# EAGLE board 24x16_RGB_ATXMega (EAGLE 6.5.0)
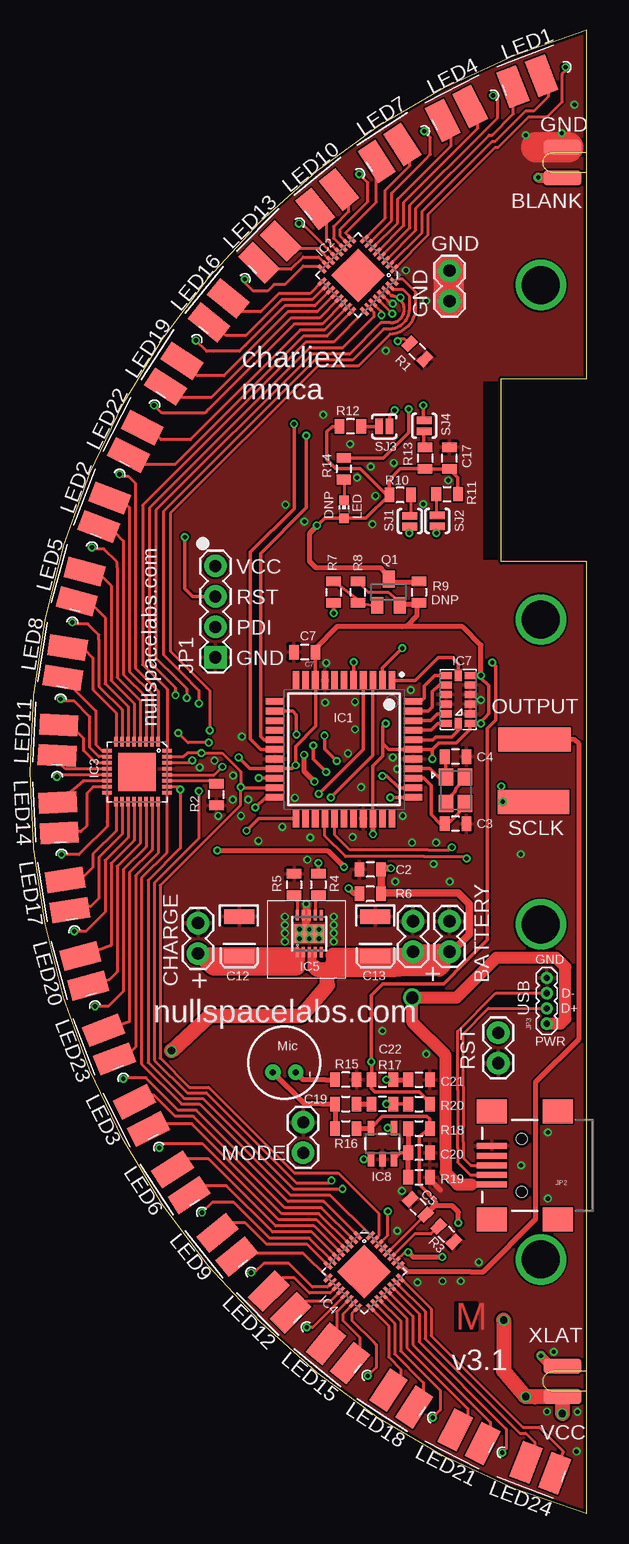
[diagram p8: board, top side]
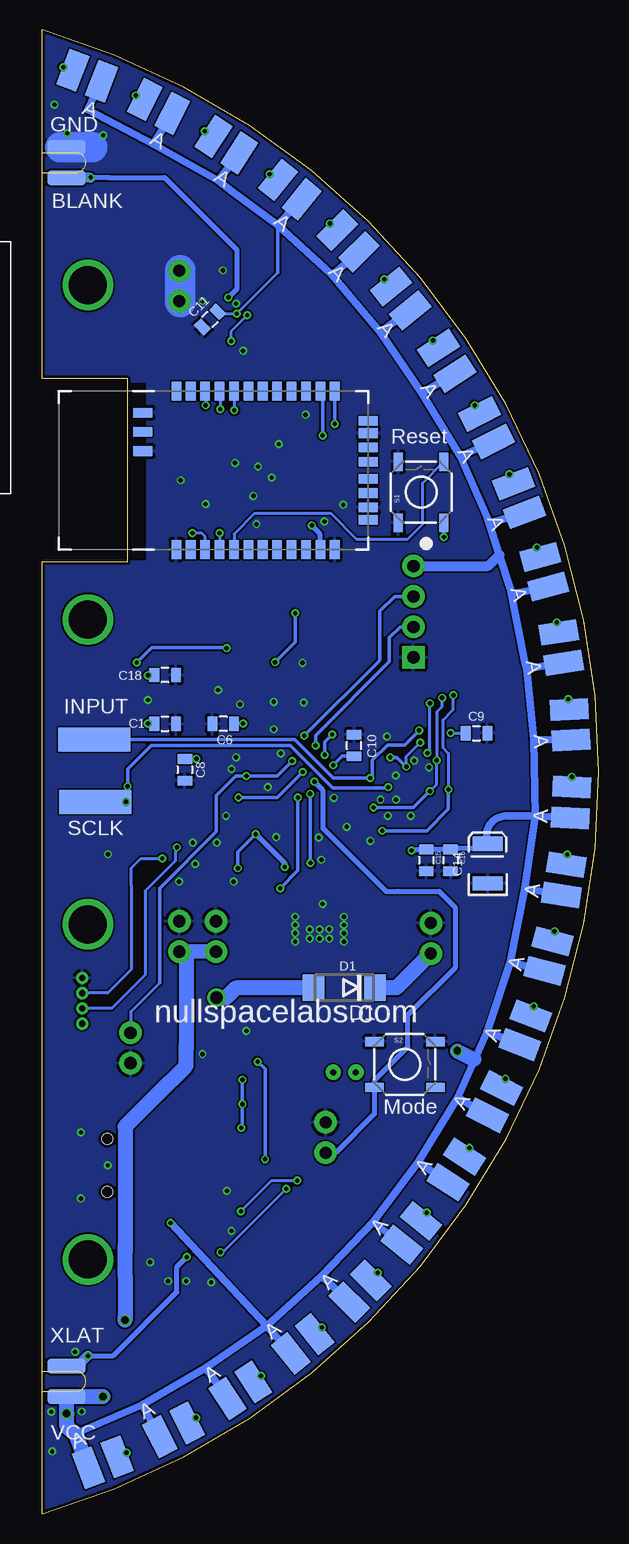
[diagram p9: board, bottom side, seen from below]

Size 46.39 x 123.7 mm. Coordinates in mm from the lower left corner, seen from the top.
Outline: 46.39,0 arc-147 46.39,123.7 46.39,94.61 39.27,94.61 39.27,79.38 46.39,79.38 46.39,0
Copper layers (1*16): Top 0.035mm / dielectric 1.5mm / Bottom 0.035mm
Design rules "ITEADstudio_DRC": minimum track width 6mil, minimum drill 12mil, track to track 6mil, track to pad 6mil, pad to pad 6mil, via to via 6mil, smd to smd 0mil, copper to edge 10mil, drill to drill 10mil, minimum pad ring 10mil, minimum via ring 6mil, stop-mask expansion 2mil, vias tented up to drill 100mil, thermal gap 10mil

## Footprints (pad centres in the part's own frame; a part is rotated, then mirrored left to right if it is on the bottom)
1X02 = drill 1.016 pad 1.88: 1 0,0; 2 2.54,0
0805 = smd 0.8 x 1.2: 1 -0.9,0; 2 0.9,0
EIA3528 = smd 1.2 x 2.5: A 1.65,0; C -1.65,0
DO214AA = smd 1.8 x 2.2: A 2.55,0; C -2.55,0
NONOLITH_TQFP-44 = smd 1.55 x 0.55: 1 -5.75,4; 2 -5.75,3.2; 3 -5.75,2.4; 4 -5.75,1.6; 5 -5.75,0.8; 6 -5.75,0; 7 -5.75,-0.8; 8 -5.75,-1.6; 9 -5.75,-2.4; 10 -5.75,-3.2; 11 -5.75,-4; 23 5.75,-4; 24 5.75,-3.2; 25 5.75,-2.4; 26 5.75,-1.6; 27 5.75,-0.8; 28 5.75,0; 29 5.75,0.8; 30 5.75,1.6; 31 5.75,2.4; 32 5.75,3.2; 33 5.75,4 | smd 0.55 x 1.55: 12 -4,-5.75; 13 -3.2,-5.75; 14 -2.4,-5.75; 15 -1.6,-5.75; 16 -0.8,-5.75; 17 0,-5.75; 18 0.8,-5.75; 19 1.6,-5.75; 20 2.4,-5.75; 21 3.2,-5.75; 22 4,-5.75; 34 4,5.75; 35 3.2,5.75; 36 2.4,5.75; 37 1.6,5.75; 38 0.8,5.75; 39 0,5.75; 40 -0.8,5.75; 41 -1.6,5.75; 42 -2.4,5.75; 43 -3.2,5.75; 44 -4,5.75
QFN32_XLP = smd 0.285 x 0.8: 1 -1.75,-2.5; 2 -1.25,-2.5; 3 -0.75,-2.5; 4 -0.25,-2.5; 5 0.25,-2.5; 6 0.75,-2.5; 7 1.25,-2.5; 8 1.75,-2.5; 17 1.75,2.5; 18 1.25,2.5; 19 0.75,2.5; 20 0.25,2.5; 21 -0.25,2.5; 22 -0.75,2.5; 23 -1.25,2.5; 24 -1.75,2.5 | smd 0.8 x 0.285: 9 2.5,-1.75; 10 2.5,-1.25; 11 2.5,-0.75; 12 2.5,-0.25; 13 2.5,0.25; 14 2.5,0.75; 15 2.5,1.25; 16 2.5,1.75; 25 -2.5,1.75; 26 -2.5,1.25; 27 -2.5,0.75; 28 -2.5,0.25; 29 -2.5,-0.25; 30 -2.5,-0.75; 31 -2.5,-1.25; 32 -2.5,-1.75 | smd 3.15 x 3.15: EP 0,0
DFN10_3X3 = smd 0.3 x 0.85: 1 -1,-1.55; 2 -0.5,-1.55; 3 0,-1.55; 4 0.5,-1.55; 5 1,-1.55; 6 1,1.55; 7 0.5,1.55; 8 0,1.55; 9 -0.5,1.55; 10 -1,1.55 | smd 2.48 x 1.55: EXP 0,0
RN41 = smd 0.8 x 1.6: 1 -6.6,-6.6; 2 -5.4,-6.6; 3 -4.2,-6.6; 4 -3,-6.6; 5 -1.8,-6.6; 6 -0.6,-6.6; 7 0.6,-6.6; 8 1.8,-6.6; 9 3,-6.6; 10 4.2,-6.6; 11 5.4,-6.6; 12 6.6,-6.6; 13 6.6,6.6; 14 5.4,6.6; 15 4.2,6.6; 16 3,6.6; 17 1.8,6.6; 18 0.6,6.6; 19 -0.6,6.6; 20 -1.8,6.6; 21 -3,6.6; 22 -4.2,6.6; 23 -5.4,6.6; 24 -6.6,6.6 | smd 1.6 x 0.8: 25 -9.4,4.8; 26 -9.4,3.2; 27 -9.4,1.6; 28 9.4,3.1; 29 9.4,-3.1; 30 9.4,-4.122; 31 9.4,-1.9; 32 9.4,-0.7; 33 9.4,0.7; 34 9.4,1.9; 35 9.4,4.122
LGA-14 = smd 0.6 x 0.9: 1 -2,-1; 2 -1.2,-1; 3 -0.4,-1; 4 0.4,-1; 5 1.2,-1; 6 2,-1; 8 2,1; 9 1.2,1; 10 0.4,1; 11 -0.4,1; 12 -1.2,1; 13 -2,1 | smd 0.9 x 0.6: 7 2,0; 14 -2,0
SOT23-5 = smd 0.55 x 1.2: 1 -0.95,-1.3; 2 0,-1.3; 3 0.95,-1.3; 4 0.95,1.3; 5 -0.95,1.3
1X04 = drill 1.016 pad 1.88 square: 1 0,0 | drill 1.016 pad 1.88: 2 2.54,0; 3 5.08,0; 4 7.62,0
USB-MINIB = smd 2.5 x 0.5: D+ 2.5,0; D- 2.5,0.8; GND 2.5,-1.6; ID 2.5,-0.8; VBUS 2.5,1.6 | smd 2.5 x 2: MTN1 -3,4.5; MTN2 2.5,4.5; MTN3 -3,-4.5; MTN4 2.5,-4.5 | hole 0.9: 0,2.2; 0,-2.2
1X04-1.27MM = drill 0.508 pad 1: 1 0,0; 2 1.27,0; 3 2.54,0; 4 3.81,0
CHIP-LED0603 = smd 0.8 x 0.8: A 0,-0.75; C 0,0.75
LED5MM_RGB_EDGE = smd 1.75 x 3.175 bottom: A -0.585,-1.6; B 1.971,-1.6 | smd 1.75 x 3.175: G 0.693,-1.6; R -1.863,-1.6
MIC-6MM = drill 0.5 pad 1.27: 1 -0.8,0.95; 2 -0.8,-0.95
SOT23 = smd 1 x 1.4: 1 -0.95,-1.1; 2 0.95,-1.1; 3 0,1.1
TACTILE_SWITCH_SMD = smd 1.524 x 0.762: 1 -2.54,1.905; 2 2.54,1.905; 3 -2.54,-1.905; 4 2.54,-1.905
SJ_2S-NO = smd 0.635 x 1.27: 1 -0.45,0; 2 0.45,0
SLOT = smd 3.175 x 1.27: P$1 2.032,1.27; P$2 2.032,-1.27 | smd 3.175 x 1.27 bottom: P$3 2.032,1.27; P$4 2.032,-1.27
TP20SQ = smd 2 x 2: TP 0,0
ZG2100MC = smd 0.85 x 0.8: 1 0.21,29.27; 2 0.21,28; 3 0.21,26.73; 4 0.21,25.46; 5 0.21,24.19; 6 0.21,22.92; 7 0.21,21.65; 8 0.21,20.38; 9 0.21,19.11; 10 0.21,17.84; 11 0.21,16.57; 12 0.21,15.3; 13 0.21,14.03; 14 0.21,12.76; 15 0.21,11.49; 16 0.21,10.22; 17 0.21,8.95; 18 0.21,7.68; 19 20.77,7.68; 20 20.77,8.95; 21 20.77,10.22; 22 20.77,11.49; 23 20.77,12.76; 24 20.77,14.03; 25 20.77,15.3; 26 20.77,16.57; 27 20.77,17.84; 28 20.77,19.11; 29 20.77,20.38; 30 20.77,21.65; 31 20.77,22.92; 32 20.77,24.19; 33 20.77,25.46; 34 20.77,26.73; 35 20.77,28; 36 20.77,29.27
NX3225GA = smd 1.4 x 1.2: 1 -1.1,-0.8; 2 1.1,-0.8; 3 1.1,0.8; 4 -1.1,0.8

## Placement (x,y rotation side)
BATTERY  [1X02]  31.91,49.4 270 top
BATTERY1  [1X02]  34.96,49.4 270 top
C1  .1uF  [0805]  36.15,65.86 0 bottom
C2  .1uF  [0805]  28.35,53.72 180 top
C3  10pF  [0805]  35.46,57.53 180 top
C4  10pF  [0805]  35.46,63.12 180 top
C5  .1uF  [0805]  32.34,25.59 135 top
C6  .1uF  [0805]  31.3,65.86 180 bottom
C7  .1uF  [0805]  22.89,71.83 180 top
C8  0.1uF  [0805]  34.5,62.03 270 bottom
C9  .1uF  [0805]  10.19,65.07 0 bottom
C10  .1uF  [0805]  20.4,64.06 90 bottom
C11  .1uF  [0805]  32.41,99.57 225 bottom
C12  4.7uF  [EIA3528]  17.43,48.13 270 top
C13  4.7uF  [EIA3528]  28.78,48.13 270 top
C14  47uF  [EIA3528]  9.28,54.2 90 bottom
C15  10uF  [0805]  14.38,54.48 270 bottom
C16  1uF  [0805]  12.35,54.48 270 bottom
C17  .1uF  [0805]  34.95,88.01 90 top
C18  0.1uF  [0805]  36.15,69.93 180 bottom
C19  4.7uF  [0805]  26.32,34.16 0 top
C20  1uF  [0805]  32.42,30.1 180 top
C21  .1uF  [0805]  32.42,36.19 0 top
C22  12pF  [0805]  29.37,36.19 0 top
CHARGE  [1X02]  14,49.25 270 top
D1  SSB44-E3/52T  [DO214AA]  21.22,43.87 180 bottom
GND  [1X02]  34.96,101.09 90 top
IC1  [NONOLITH_TQFP-44]  26.17,63.73 270 top
IC2  TLC5947XLP  [QFN32_XLP]  27.34,103.25 135 top
IC3  TLC5947XLP  [QFN32_XLP]  8.92,61.85 180 top
IC4  TLC5947XLP  [QFN32_XLP]  27.84,20.19 225 top
IC5  MCP73123  [DFN10_3X3]  23.27,48.36 0 top
IC6  BLUETOOTH-RN41"  [RN41]  28.61,87 0 bottom
IC7  MMA7455L  [LGA-14]  35.69,67.89 90 top
IC8  OPA344  [SOT23-5]  29.37,30.86 0 top
JP1  [1X04]  15.45,71.4 90 top
JP2  USBSMD  [USB-MINIB]  40.98,29.06 180 top
JP3  [1X04-1.27MM]  43.06,40.87 90 top
LED  [CHIP-LED0603]  26.17,83.74 0 top
LED1  GM1WA55311A5MM_RGB_EDGE  [LED5MM_RGB_EDGE]  41.41,121.13 21 top
LED2  GM1WA55311A5MM_RGB_EDGE  [LED5MM_RGB_EDGE]  4.91,84.6 69 top
LED3  GM1WA55311A5MM_RGB_EDGE  [LED5MM_RGB_EDGE]  7.59,33.02 117 top
LED4  GM1WA55311A5MM_RGB_EDGE  [LED5MM_RGB_EDGE]  35.34,118.43 27 top
LED5  GM1WA55311A5MM_RGB_EDGE  [LED5MM_RGB_EDGE]  2.83,78.28 75 top
LED6  GM1WA55311A5MM_RGB_EDGE  [LED5MM_RGB_EDGE]  10.91,27.26 123 top
LED7  GM1WA55311A5MM_RGB_EDGE  [LED5MM_RGB_EDGE]  29.58,115.11 33 top
LED8  GM1WA55311A5MM_RGB_EDGE  [LED5MM_RGB_EDGE]  1.45,71.78 81 top
LED9  GM1WA55311A5MM_RGB_EDGE  [LED5MM_RGB_EDGE]  14.82,21.89 129 top
LED10  GM1WA55311A5MM_RGB_EDGE  [LED5MM_RGB_EDGE]  24.21,111.2 39 top
LED11  GM1WA55311A5MM_RGB_EDGE  [LED5MM_RGB_EDGE]  0.75,65.17 87 top
LED12  GM1WA55311A5MM_RGB_EDGE  [LED5MM_RGB_EDGE]  19.26,16.95 135 top
LED13  GM1WA55311A5MM_RGB_EDGE  [LED5MM_RGB_EDGE]  19.26,106.75 45 top
LED14  GM1WA55311A5MM_RGB_EDGE  [LED5MM_RGB_EDGE]  0.75,58.53 93 top
LED15  GM1WA55311A5MM_RGB_EDGE  [LED5MM_RGB_EDGE]  24.21,12.5 141 top
LED16  GM1WA55311A5MM_RGB_EDGE  [LED5MM_RGB_EDGE]  14.84,101.79 51 top
LED17  GM1WA55311A5MM_RGB_EDGE  [LED5MM_RGB_EDGE]  1.45,51.92 99 top
LED18  GM1WA55311A5MM_RGB_EDGE  [LED5MM_RGB_EDGE]  29.58,8.59 147 top
LED19  GM1WA55311A5MM_RGB_EDGE  [LED5MM_RGB_EDGE]  10.96,96.41 57 top
LED20  GM1WA55311A5MM_RGB_EDGE  [LED5MM_RGB_EDGE]  2.83,45.42 105 top
LED21  GM1WA55311A5MM_RGB_EDGE  [LED5MM_RGB_EDGE]  35.34,5.27 153 top
LED22  GM1WA55311A5MM_RGB_EDGE  [LED5MM_RGB_EDGE]  7.61,90.65 63 top
LED23  GM1WA55311A5MM_RGB_EDGE  [LED5MM_RGB_EDGE]  4.88,39.09 111 top
LED24  GM1WA55311A5MM_RGB_EDGE  [LED5MM_RGB_EDGE]  41.41,2.57 159 top
MIC1  MIC6MM  [MIC-6MM]  21.19,37.62 90 top
MODE  [1X02]  22.76,32.64 270 top
Q1  BSH201  [SOT23]  29.88,76.83 0 top
R1  20K  [0805]  32.27,96.91 135 top
R2  20K  [0805]  15.53,59.97 90 top
R3  20K  [0805]  34.69,23.32 135 top
R4  1K  [0805]  24.03,52.45 270 top
R5  1K  [0805]  22,52.45 270 top
R6  220K  [0805]  28.35,51.69 180 top
R7  10k  [0805]  25.3,76.83 270 top
R8  10k  [0805]  27.33,76.83 90 top
R9  0ohm DNP  [0805]  32.42,76.83 270 top
R10  1k  [0805]  30.84,84.94 180 top
R11  1k  [0805]  34.75,85.01 0 top
R12  1k  [0805]  26.7,90.65 180 top
R13  1k  [0805]  32.92,88.01 270 top
R14  220  [0805]  26.14,87.12 270 top
R15  4.7k  [0805]  26.32,36.19 180 top
R16  2.2k  [0805]  26.32,32.13 0 top
R17  10k  [0805]  29.37,34.16 180 top
R18  10k  [0805]  32.42,32.13 0 top
R19  10k  [0805]  32.42,28.07 0 top
R20  1M  [0805]  32.42,34.16 0 top
RST  [1X02]  39.02,37.57 90 top
S1  [TACTILE_SWITCH_SMD]  14.81,85.17 90 bottom
S2  [TACTILE_SWITCH_SMD]  16.16,37.46 0 bottom
SJ1  SOLDERJUMPERNO  [SJ_2S-NO]  31.65,82.75 90 top
SJ2  SOLDERJUMPERNO  [SJ_2S-NO]  33.94,82.78 90 top
SJ3  SOLDERJUMPERNO  [SJ_2S-NO]  29.52,90.65 180 top
SJ4  SOLDERJUMPERNO  [SJ_2S-NO]  32.85,90.7 270 top
SLOT1  SLOT  [SLOT]  46.39,11.05 180 top
SLOT2  SLOT  [SLOT]  46.39,112.65 180 top
TP1  TPTP20SQ  [TP20SQ]  42.04,64.57 0 top
TP2  TPTP20SQ  [TP20SQ]  40.04,64.57 0 top
TP3  TPTP20SQ  [TP20SQ]  41.97,59.36 0 top
TP4  TPTP20SQ  [TP20SQ]  39.99,59.36 0 bottom
TP5  TPTP20SQ  [TP20SQ]  42.04,64.57 0 bottom
TP6  TPTP20SQ  [TP20SQ]  40.04,64.57 0 bottom
TP7  TPTP20SQ  [TP20SQ]  43.97,59.36 0 bottom
TP8  TPTP20SQ  [TP20SQ]  41.99,59.36 0 bottom
TP9  TPTP20SQ  [TP20SQ]  44.05,64.57 0 top
TP10  TPTP20SQ  [TP20SQ]  39.99,59.36 0 top
TP11  TPTP20SQ  [TP20SQ]  44.05,64.57 0 bottom
TP12  TPTP20SQ  [TP20SQ]  43.95,59.36 0 top
U$5  ZG2100MC  [ZG2100MC]  80.02,106.04 270 bottom  (outside the outline)
X1  NX3225GA XC1972CT-ND  [NX3225GA]  35.46,60.32 270 top

## Tracks (layer width: path | path; a pad name or v marks a point on that pad's centre or on a via)
!CS
  Top 0.305: IC7.7 35.67,69.92 35.67,70.89 35.19,71.37 34.02,71.37 32.12,69.48 IC1.1
BATTSENSE  (via drill 0.36)
  Top 0.305: v25.08,59.71 28.57,63.21 IC1.3
  Top 0.406: R6.2 27.01,51.69 v26.55,52.15
  Bottom 0.305: v26.55,52.15 25.08,53.62 v25.08,59.71
BLANK  (via drill 0.36)
  Top 0.254: v13.52,62.81 13.4,62.6 IC3.30 | v25.13,27.79 24.95,27.61 22.18,27.61 14.69,35.1 13.09,35.1 10.37,37.82 10.37,52.6 14.08,56.31 v14.08,60.25 | 30.1,101.55 30.11,101.55 arc-177 30.05,99.29 29.24,99.29 26.63,96.67 23.5,96.67 10.5,83.67 10.5,71.35 12.22,69.62 13.06,68.78 v13.06,68.02 | 30.1,101.55 IC2.30 | 30.1,101.55 30.1,101.57 v30.87,101.4 | 44.33,111.4 SLOT2.P$3 | IC4.30 29.83,23.23 v29.83,25.22
  Top 0.305: IC1.22 19.63,59.73 v18.78,58.88
  Top 0.813: v42.35,111.4 44.33,111.4
  Bottom 0.254: v42.35,111.4 42.37,111.38 | v13.06,68.02 13.06,67.28 13.52,66.83 v13.52,62.81 13.52,60.81 v14.08,60.25 | v29.83,25.22 27.26,27.79 v25.13,27.79
  Bottom 0.305: v18.78,58.88 15.45,58.88 v14.08,60.25
  Bottom 0.406: v42.35,111.4 40.87,111.4 36.18,111.4 30.16,105.38 30.16,102.11 v30.87,101.4
  Bottom 0.813: 42.37,111.38 SLOT2.P$3
BT_PWR  (via drill 0.36)
  Top 0.305: v26.98,70.99 v26.97,70.98 IC1.5 | R7.2 v25.3,75.08
  Bottom 0.305: v25.3,75.08 25.3,72.67 v26.98,70.99
BT_RST
  Bottom 0.254: S1.4 14.69,85.93 14.69,82.5 15.91,81.28 20.2,81.28 22.33,83.41 28.66,83.41 30.38,81.69 30.38,80.42
  Bottom 0.305: 30.38,80.42 IC6.5
BUTTON  (via drill 0.36)
  Top 0.305: IC1.13 21.88,66.93 22.21,66.6 v22.21,64.97
  Top 0.406: v23.7,61.04 22.84,61.9 v22.84,63.27
  Bottom 0.254: 18.65,35.46 S2.3
  Bottom 0.305: v22.84,63.27 22.84,64.34 v22.21,64.97
  Bottom 0.406: MODE.2 21.93,30.1 18.7,33.32 S2.3 18.7,36.12 15.91,38.91 15.91,41.58 11.97,45.52 11.97,50.57 13.29,51.89 16.74,51.89 17.74,51.89 22.23,56.39 22.97,57.12 22.97,60.3 v23.7,61.04
CHARGE
  Top 0.254: IC5.1 21.92,46.46 21.82,46.46 | 21.82,46.46 C12.A | 22.13,47.07 22.82,47.07 22.82,46.46 21.82,46.46 | 21.82,46.46 21.82,46.56
  Top 0.305: IC5.2 IC5.1 22.27,46.74
  Top 0.813: 22.17,46.71 IC5.1
  Top 1.27: CHARGE.2 15.2,45.52 22.28,45.52 22.28,46.25 21.95,46.58 14.33,46.58 14.43,46.48 C12.A
  Bottom 1.016: 14,46.48 CHARGE.2
  Bottom 1.27: D1.C 16.85,43.87 CHARGE.2
COL1  (via drill 0.36)
  Top 0.254: IC2.1 33.18,106.62 33.18,108.33 38.77,113.92 39.02,113.92 41.56,116.46 42.83,116.46 43.11,116.46 44.35,117.7 44.35,120.04 44.63,120.32 v44.63,120.6
  Bottom 0.305: LED1.B 44.1,120.07 v44.63,120.6
COL2
  Top 0.254: IC2.2 32.67,106.82 32.67,108.58 38.51,114.43 38.77,114.43 41.31,116.97 42.02,116.97 43.21,118.16 43.21,119.31 LED1.G
COL3
  Top 0.254: IC2.3 32.16,107.02 32.16,108.84 38.26,114.94 38.51,114.94 40.29,116.71 40.29,118.75 LED1.R
COL4  (via drill 0.36)
  Top 0.254: IC2.4 31.65,107.22 31.65,109.09 37.67,115.09 38.97,116.38 38.97,117.6 38.97,117.86 v38.59,118.24
  Bottom 0.254: LED4.B arc-90 38.46,117.25 38.46,118.11 v38.59,118.24
COL5
  Top 0.254: IC2.5 31.15,107.41 31.15,109.35 37.32,115.52 37.32,116.15 36.68,116.79 LED4.G
COL6
  Top 0.254: IC2.6 30.64,107.61 30.64,109.6 35.08,114.05 35.08,114.96 34.4,115.64 LED4.R
COL7  (via drill 0.36)
  Top 0.254: IC2.7 30.13,107.81 30.13,110.11 32.92,112.9 33.36,113.33 33.36,114.76 v32.85,115.26
  Bottom 0.254: LED7.B 32.11,114.36 v32.85,115.26
COL8
  Top 0.254: IC2.8 29.62,108.01 29.62,110.36 31.65,112.39 31.65,113.06 31.5,113.21 31.5,113.67 LED7.G
COL9
  Top 0.254: IC2.9 26.32,106.74 26.32,106.81 28.86,109.35 28.86,112.39 LED7.R
COL10  (via drill 0.36)
  Top 0.254: IC2.10 25.81,106.54 25.81,107.06 27.59,108.84 28.15,109.4 28.15,110.31 28.15,110.97 v27.44,111.68
  Bottom 0.254: 26.74,110.88 LED10.B 26.95,111.19 v27.44,111.68 27.59,110.03
COL11
  Top 0.254: IC2.11 25.3,106.34 25.3,107.31 26.57,108.58 26.57,109.09 25.51,110.16 LED10.G
COL12
  Top 0.254: IC2.12 24.72,106.22 24.72,107.83 LED10.R
COL13  (via drill 0.36)
  Top 0.254: IC2.13 22.92,107.31 v22.41,107.57
  Bottom 0.254: LED13.B v22.41,107.57
COL14
  Top 0.254: IC2.14 24.07,105.46 21.9,105.46 21.25,106.11 LED13.G
COL15
  Top 0.254: IC2.15 24.04,104.78 22.76,104.78 21.75,103.76 20.05,103.76 19.5,104.3 LED13.R
COL16  (via drill 0.36)
  Top 0.254: IC2.16 24.1,104.01 22.76,104.01 21.24,102.49 20.35,102.49 19.79,101.93 18.6,101.93 17.89,102.64 v17.89,102.92
  Bottom 0.254: LED16.B 17.51,102.31 v17.89,102.92
COL17
  Top 0.254: IC2.17 23.34,101.73 20.73,101.73 19.21,100.2 17.43,100.2 16.53,101.1 LED16.G
COL18
  Top 0.254: IC2.18 23.54,101.22 20.99,101.22 17.99,98.22 16.31,98.22 15.2,99.33 LED16.R
COL19  (via drill 0.36)
  Top 0.254: IC2.19 23.74,100.71 21.24,100.71 17.94,97.41 17.46,96.93 15.27,96.93 14.71,96.93 v13.82,97.81
  Bottom 0.254: LED19.B 13.6,97.41 v13.82,97.81
COL20
  Top 0.254: IC2.20 23.94,100.2 21.49,100.2 16.16,94.87 13.93,94.87 LED19.G 12.86,95.88
COL21
  Top 0.254: IC2.21 24.13,99.69 21.75,99.69 15.12,93.07 12.66,93.07 11.75,93.97 LED19.R
COL22  (via drill 0.36)
  Top 0.254: IC2.22 24.33,99.19 22,99.19 14.89,92.07 14.59,91.77 11.46,91.77 10.98,91.77 v10.34,92.41
  Bottom 0.254: LED22.B 10.43,91.68 arc90 v10.34,92.41
COL23
  Top 0.254: IC2.23 24.53,98.68 22.51,98.68 13.37,89.53 10.93,89.53 10.55,89.92 9.98,89.92 LED22.G 10.07,90.29
COL24
  Top 0.254: IC2.24 24.73,98.17 22.76,98.17 12.07,87.48 8.98,87.48 LED22.R
COL25  (via drill 0.36)
  Top 0.254: IC3.1 10.67,68.61 8.79,70.48 8.79,85.9 8.21,86.49 7.63,86.49 v7.45,86.66
  Bottom 0.254: LED2.B 7.59,85.87 arc90 v7.45,86.66
COL26
  Top 0.254: IC3.2 10.17,68.35 8.29,70.23 8.29,83.9 7.91,84.28 7.05,84.28 LED2.G
COL27
  Top 0.254: IC3.3 9.67,68.08 7.78,69.98 7.78,81.1 7.04,81.84 6.19,81.84 LED2.R
COL28  (via drill 0.36)
  Top 0.254: IC3.4 9.17,67.82 7.27,69.72 7.27,78.89 7.27,79.32 6.15,80.44 5.29,80.44 v5.16,80.57
  Bottom 0.254: LED5.B 5.46,79.77 v5.16,80.57
COL29
  Top 0.254: IC3.5 8.67,67.56 6.76,69.47 6.76,77.37 6,78.13 4.96,78.13 LED5.G
COL30
  Top 0.254: IC3.6 8.17,67.3 6.25,69.22 6.25,74.73 5.26,75.72 4.25,75.72 LED5.R
COL31  (via drill 0.36)
  Top 0.254: IC3.7 7.67,67.04 5.75,68.96 5.75,72.85 5.75,73.28 4.83,74.19 3.64,74.19 v3.51,74.32
  Bottom 0.254: LED8.B 4.04,73.48 v3.51,74.32
COL32
  Top 0.254: IC3.8 7.17,66.77 5.24,68.71 5.24,71.35 4.55,72.03 3.32,72.03 LED8.G
COL33
  Top 0.254: IC3.9 6.03,63.6 5.49,64.13 5.49,66.93 2.85,69.57 LED8.R
COL34  (via drill 0.36)
  Top 0.254: IC3.10 6.4,63.12 5.75,63.12 4.98,63.88 4.98,65.99 4.98,66.45 3.69,67.74 2.72,67.74 v2.55,67.92
  Bottom 0.254: LED11.B 2.75,67.06 v2.55,67.92
COL35
  Top 0.254: LED11.G 2.44,65.41 3.71,65.41 4.48,64.64 4.48,63.63 5.5,62.6 IC3.11
COL36
  Top 0.254: IC3.12 2.95,62.1 2.29,62.76 LED11.R
COL37  (via drill 0.36)
  Top 0.254: IC3.13 2.95,61.59 2.39,61.59 v2.24,61.44
  Bottom 0.254: LED14.B 2.25,60.78 v2.24,61.44
COL38
  Top 0.254: 6.42,61.09 IC3.14 4.43,61.1 LED14.G
COL39
  Top 0.254: IC3.15 5.26,60.6 4.73,60.07 4.73,57.35 4.25,56.87 2.57,56.87 LED14.R
COL40  (via drill 0.36)
  Top 0.254: IC3.16 6.42,57.7 6.42,57.32 4.32,55.22 4.07,54.97 v2.62,54.97
  Bottom 0.254: LED17.B 2.72,54.35 v2.62,54.97
COL41
  Top 0.254: IC3.17 7.17,56.92 5.24,54.99 5.24,53.9 4.45,53.11 3.18,53.11 LED17.G 3.13,52.7
COL42
  Top 0.254: IC3.18 7.67,56.66 5.75,54.74 5.75,51.31 5.06,50.62 3.62,50.62 LED17.R
COL43  (via drill 0.36)
  Top 0.254: IC3.19 8.17,56.4 6.25,54.48 6.25,50.16 4.65,48.56 v3.69,48.56
  Bottom 0.254: LED20.B 3.87,48.31 v3.69,48.56
COL44
  Top 0.254: IC3.20 8.67,56.14 6.76,54.23 6.76,47.37 4.68,46.61 LED20.G
COL45
  Top 0.254: IC3.21 9.17,55.88 7.27,53.97 7.27,45.19 6.61,44.53 LED20.R
COL46  (via drill 0.36)
  Top 0.254: IC3.22 9.67,55.61 7.78,53.72 7.78,43.56 6.53,42.32 v5.42,42.32
  Bottom 0.254: LED23.B v5.42,42.32
COL47
  Top 0.254: IC3.23 10.17,55.35 8.29,53.47 8.29,41.02 LED23.G 6.73,40.51
COL48
  Top 0.254: IC3.24 10.67,55.09 8.79,53.21 8.79,38.91 8.24,38.35 7.47,38.35 LED23.R
COL49  (via drill 0.36)
  Top 0.254: IC4.1 24.48,26.03 21.49,26.03 13.87,33.66 12.35,33.66 9.66,36.35 7.85,36.35 v7.78,36.27
  Bottom 0.254: LED3.B 8.26,35.64 v7.78,36.27
COL50
  Top 0.254: IC4.2 24.28,25.53 21.24,25.53 13.62,33.15 12.1,33.15 10.34,34.9 9.56,34.9 9.02,34.36 LED3.G
COL51
  Top 0.254: IC4.3 24.08,25.02 20.99,25.02 13.49,32.51 10.95,32.51 10.53,32.09 LED3.R
COL52  (via drill 0.36)
  Top 0.254: IC4.4 23.88,24.51 20.73,24.51 14.56,30.68 14.38,30.86 11.54,30.86 11.13,30.86 v10.78,30.5
  Bottom 0.254: v10.78,30.5 11.36,29.79 LED6.B
COL53
  Top 0.254: IC4.5 23.68,24 20.48,24 14.89,29.59 13.06,29.59 12.19,28.72 LED6.G
COL54
  Top 0.254: IC4.6 23.48,23.49 20.22,23.49 16.36,27.36 14.33,27.36 13.55,26.57 LED6.R
COL55  (via drill 0.36)
  Top 0.254: IC4.7 23.28,22.99 19.97,22.99 17.81,25.15 17,25.96 15.17,25.96 v14.33,25.12
  Bottom 0.254: LED9.B 14.87,24.47 v14.33,25.12
COL56
  Top 0.254: IC4.8 23.08,22.48 19.72,22.48 17.94,24.26 16.92,24.26 15.86,23.19 LED9.G
COL57
  Top 0.254: IC4.9 22.78,21.72 17.18,21.72 17.23,21.66 LED9.R
COL58  (via drill 0.36)
  Top 0.254: IC4.10 24.81,18.92 23.53,18.92 21.55,20.9 19.49,20.9 18.7,20.12 v18.42,20.12
  Bottom 0.254: LED12.B v18.42,20.12
COL59
  Top 0.254: IC4.11 25.01,18.41 23.27,18.41 22,19.68 21.04,19.68 19.92,18.57 LED12.G 20.16,18.35
COL60
  Top 0.254: IC4.12 25,17.7 22.54,17.7 arc90 22.21,17.37 22.21,17.25 arc-90 LED12.R
COL61  (via drill 0.36)
  Top 0.254: IC4.13 23.55,15.54 v23.07,15.54
  Bottom 0.254: LED15.B 23.68,15.88 v23.07,15.54
COL62
  Top 0.254: IC4.14 25.56,16.85 25.56,15.11 24.91,14.47 LED15.G
COL63
  Top 0.254: IC4.15 26.07,16.65 26.07,16.13 27.49,14.71 27.49,13.31 26.75,12.57 LED15.R
COL64  (via drill 0.36)
  Top 0.254: IC4.16 26.83,16.7 26.83,16.13 28.63,14.33 28.86,14.1 28.86,12.57 28.86,12.22 v28.15,11.51
  Bottom 0.254: LED18.B 28.67,11.01 v28.15,11.51
COL65
  Top 0.254: IC4.17 29.88,15.69 29.88,13.08 30.89,12.06 30.89,11.3 30.13,10.54 LED18.G
COL66
  Top 0.254: IC4.18 30.38,15.88 30.38,13.33 32.77,10.95 32.77,10.08 32.02,9.33 LED18.R
COL67  (via drill 0.36)
  Top 0.254: IC4.19 30.89,16.08 30.89,13.59 34.19,10.29 34.19,8.66 v33.56,8.03
  Bottom 0.254: LED21.B 34.1,7.59 v33.56,8.03
COL68
  Top 0.254: IC4.20 31.4,16.28 31.4,13.84 36.48,8.76 36.48,8.25 35.72,7.5 LED21.G
COL69
  Top 0.254: IC4.21 31.91,16.48 31.91,14.1 38.36,7.64 38.36,6.91 37.72,6.27 LED21.R
COL70  (via drill 0.36)
  Top 0.254: IC4.22 32.42,16.68 32.42,14.35 39.66,7.11 39.71,7.06 39.71,5.82 39.71,5.46 v39.35,5.1
  Bottom 0.254: LED24.B 39.66,5.25 v39.35,5.1
COL71
  Top 0.254: IC4.23 32.92,16.88 32.92,14.6 40.8,6.73 41.31,6.73 42.07,5.97 42.07,5.46 41.62,5.02 LED24.G
COL72
  Top 0.254: IC4.24 33.43,17.08 33.43,14.86 41.05,7.24 42.42,7.24 44.43,5.23 LED24.R
D+  (via drill 0.36)
  Top 0.254: IC1.27 25.41,57.94 25.41,56.59 26.65,55.35 33.18,55.35 34.93,55.35 v35.16,55.57 | JP3.2 38.21,42.14 36.1,40.03 36.1,35.64 36.1,32.23 36.1,31.01 36.1,29.69 36.73,29.06 JP2.D+
  Bottom 0.254: v35.16,55.57 35.29,55.19 35.29,54.43 37.8,51.92 37.8,44.91 40.57,42.14 JP3.2
D-  (via drill 0.36)
  Top 0.254: IC1.26 24.57,56.52 26.3,54.79 32.85,54.79 36.23,54.79 v36.38,54.63 | JP3.3 38.82,43.41 35.64,40.23 35.64,35.38 35.64,32.03 35.64,30.53 35.64,29.31 36.68,28.27 38.46,28.27 JP2.D-
  Bottom 0.254: v36.38,54.63 38.16,54.63 38.94,53.85 38.94,52.4 38.94,45.39 40.93,43.41 JP3.3
DAT  (via drill 0.36)
  Top 0.305: IC1.34 31.9,59.71 v30.03,59.71 | v23.6,64.06 23.6,62.92 v24.67,61.85
  Bottom 0.305: v30.03,59.71 26.8,59.71 v24.67,61.85 | JP1.2 16.57,73.94 17.46,73.05 17.46,71.04 23.6,64.9 v23.6,64.06
DGND
  Top 0.305: X1.2 34.66,59.32 35.13,59.92 35.39,60.17 35.54,60.5 36.26,61.3 X1.4
GND  (via drill 0.36)
  Top 0.254: v30.23,100.89 30.05,100.89 IC2.29 | 23.04,50.75 23.04,50.18 arc-90 IC5.9
  Top 0.305: 34.88,103.71 GND.2
  Top 0.406: R19.2 33.32,27.88 34.19,27
  Top 0.61: v23.27,48.72 22.99,49 22.99,49.43 23.04,49.48 23.04,50.75
  Top 2.54: 34.88,103.71 34.88,101.02 | 42.2,113.94 44.86,113.94
  Bottom 0.305: 34.88,103.68 GND.2
  Bottom 2.54: 34.88,103.68 34.88,100.99 | 42.2,113.94 44.86,113.94
  other vias: 15.68,58.19 15.37,62.79 22.46,48.74 24.09,48.72 22.46,47.96 23.27,47.96 24.09,47.96 44.3,115.09 37.57,67.84 30.23,63.07 24.59,67.64 31.07,58.19 26.88,56.41 34.37,19.41 37.4,20.98 29.37,40.26 27.08,67.69 27.08,65.41 27.59,60.58 40.93,29.06 43.64,13.51 43.08,8.53 45.37,117.47 41.31,114.94 31.32,103.66 29.65,96.95 22.08,59.69 33.03,38.33 30.44,52.7 34.98,52.7 19.03,56.11 21.01,57.28 30.99,26.92 30.61,23.6 29.9,67.49 31.73,68.68 24.44,91.62 26.68,89.18 28.4,87.3 30.31,87.6 28.78,84.86 27.26,86.39 34.86,86.16 32.77,84.18 28.53,82.5 22.87,82.73 21.29,84.12 33.03,101.12 25.3,49.78 25.3,49.1 25.3,48.41 25.3,47.7 21.24,47.7 21.24,48.41 21.24,49.1 21.24,49.78 23.02,50.85 45.62,8.51 45.55,5.21 16.92,61.54 14.15,62.23 26.5,63.4 30.61,62.1 24.7,70.94 31.83,55.96 33.64,54.18 33.84,55.96 40.9,54.99 43.16,31.8 43.16,26.29 17.58,58.19 18.19,59.54 16.9,59.54 17.66,64.8 23.35,56.39 23.12,54.53 32.29,19.3 35.9,19.41
  pour Top: 47.86,124.69 47.73,124.69 47.73,94.64 37.6,94.51 37.6,79.38 47.73,79.5 47.86,-1.5 -2.05,-1.47 -2.05,124.71
  pour Bottom: -3.65,127.13 -3.65,-5.49 48.29,-5.36 48.29,79.35 37.6,79.43 37.6,94.34 48.47,94.41 48.47,95.07 48.65,127.25 48.29,127.25
  pour Top (no thermals): 21.67,49.15 24.7,49.15 24.7,47.62 21.67,47.62
HOLE  (via drill 0.36)
  Top 0.254: IC2.27 29.24,100.28 v29.29,99.92 | R1.2 31.25,97.92 30.69,97.92 v30.64,97.76
  Bottom 0.254: 29.29,99.79 v29.29,99.92 30.64,98.58 v30.64,97.76
INT1/DRDY
  Top 0.305: IC7.8 33.81,69.9 33.74,69.9 32.85,69.01 32.85,68 32.57,67.72 31.93,67.72 IC1.44
INT2
  Top 0.305: IC1.43 33.2,66.93 33.53,67.26 33.53,68.55 34.09,69.11 34.67,69.11 IC7.9
MIC  (via drill 0.36)
  Top 0.305: v28.43,37.69 28.43,38.15 | v31.02,72.16 29.37,70.51 IC1.2 | v38.51,70.97 38.82,70.66 38.82,70.43 38.82,66.19 38.11,65.48 38.11,64.92 38.11,47.83 36.33,46.05 34.47,44.2 29.39,44.2 28.43,43.23 v28.43,37.69 | v28.43,37.69 28.47,37.65 C22.1 28.45,36.18 28.45,35.46 28.73,35.18 32.42,35.18 33.32,34.28 R20.2 | IC8.1 v27.82,29.56 v27.82,29.57
  Bottom 0.305: v31.02,72.16 31.07,72.21 37.27,72.21 v38.51,70.97 | 28.45,37.67 v28.43,37.69 27.82,37.08 v27.82,29.57
N$1
  Top 0.254: IC5.7 23.77,51.7 R4.2
N$2
  Top 0.254: IC3.27 15.83,61.1 R2.2
N$3
  Top 0.254: IC2.25 25.31,97.69 22.99,97.69 9.38,84.07 9.38,70.79 11.42,68.75 IC3.32
N$4
  Top 0.254: LED.C 26.17,86.2 R14.2
N$5
  Top 0.254: R10.1 31.74,83.29 arc-90 SJ1.2
N$6
  Top 0.254: IC5.10 22.27,51.73 R5.2
N$7  (via drill 1.02)
  Top 0.305: JP2.VBUS 36.94,27.46 36.79,27.46
  Top 1.016: 36.79,27.46 35.64,27.46 34.63,28.47 34.63,29.64 34.63,38.2 31.86,40.97 v31.86,43.03 35.54,43.03 38.87,46.35 43.85,46.35 44.61,45.59 44.61,41.27 44.2,40.87 JP3.1
  Bottom 1.27: D1.A 23.79,43.84 30.26,43.84 31.07,43.03 v31.86,43.03
N$9
  Top 0.254: IC4.27 32.05,23.34 33.41,23.34 34.02,23.96 R3.2
N$10  (via drill 3.17)
  other vias: 42.58,21.21
N$11  (via drill 3.17)
  other vias: 42.58,49.15
N$12  (via drill 3.17)
  other vias: 42.58,102.44
N$13  (via drill 3.17)
  other vias: 42.58,74.55
N$14
  Top 0.406: C19.2 R17.2
N$15
  Top 0.406: R16.1 C19.1 24.31,34.16 22.89,34.16 MIC1.1
N$16
  Top 0.305: 31.54,30 C20.2 30.86,30.1 IC8.3
  Top 0.406: R18.1 C20.2 R19.1
N$17  (via drill 0.36)
  Top 0.305: R20.1 R17.1 v29.7,34.16 | IC8.4 29.82,32.16 v29.8,32.18 | C22.2 v29.7,36.19
  Top 0.406: C22.2 C21.1
  Bottom 0.305: v29.8,32.18 29.7,32.28 v29.7,34.16 v29.7,36.19
N$18
  Top 0.254: R7.1 27.51,76.07 R8.1 27.53,75.89 Q1.1
N$19
  Top 0.254: IC4.32 24.98,26.59 21.7,26.59 14.13,34.16 12.63,34.16 9.28,37.52 9.28,53.01 11.42,55.15 IC3.25
N$20
  Top 0.406: R15.2 24.59,36.19 22.76,36.19 MIC1.2
N$21
  Top 0.305: R12.1 SJ3.2
N$23
  Top 0.254: R11.1 33.85,83.32 arc90 SJ2.2
N$24
  Top 0.254: SJ4.2 32.82,90.23
  Top 0.305: 32.82,90.23 32.82,89.01 R13.1
N$36
  Top 0.305: IC1.36 32.81,61.33 32.82,61.34 33.43,60.73 33.43,58.29 34.19,57.53 C3.2 34.77,57.73 35.03,57.73 36.26,58.97 X1.3
N$37
  Top 0.305: IC1.37 33.31,62.13 34.02,61.42 34.66,61.42 X1.1 34.66,63.02 C4.2
PIO3  (via drill 0.36)
  Top 0.305: v30.38,92 29.97,91.58 SJ3.1
  Bottom 0.254: v30.38,92 30.38,93.57 30.38,93.59 IC6.20
PIO4  (via drill 0.36)
  Top 0.305: v32.77,92.41 32.77,91.23 SJ4.1
  Bottom 0.254: v32.77,92.41 32.77,93.56 32.77,93.59 IC6.22
PIO5  (via drill 0.36)
  Top 0.305: R14.1 26.21,88.09 26.28,88.01 29.42,88.01 31.55,90.14 v31.55,92.1
  Bottom 0.254: v31.55,92.1 31.55,93.54 31.55,93.59 IC6.21
PIO6  (via drill 0.36)
  Top 0.254: SJ2.1 v33.86,81.76
  Bottom 0.254: IC6.3 32.81,81.47 33.1,81.76 v33.86,81.76
PIO7  (via drill 0.36)
  Top 0.254: v31.6,81.76 31.6,82.25 SJ1.1
  Bottom 0.254: v31.61,81.76 v31.6,81.76 v31.61,81.76 IC6.4
RST  (via drill 0.36)
  Top 0.305: IC1.35 31.89,60.5 30.77,60.5 29.75,61.52 v29.37,61.52 | v24.54,64.87 24.54,63.78 v25.56,62.76 | v12.91,81.43 12.91,77.14 13.57,76.48 JP1.3
  Bottom 0.254: 36.61,44.27 39.02,41.86 RST.2
  Bottom 0.305: v25.56,62.76 26.8,61.52 v29.37,61.52 30.26,61.52 31.88,59.89 31.88,56.87 36.61,52.15 36.61,44.27 | v24.54,64.87 18.34,71.07 18.24,71.17 18.24,75.26 17.02,76.48 JP1.3 | S1.3 12.96,82.57 12.91,82.52 v12.91,81.43
RX  (via drill 0.36)
  Top 0.305: v23.02,89.89 23.02,83.87 19.21,80.06 19.21,77.83 19.21,68.12 19.21,64.82 19.51,64.52 20.41,64.52 IC1.16
  Bottom 0.305: IC6.14 23.02,93.41 v23.02,89.89
SCL/SPC
  Top 0.305: IC1.41 33.43,65.33 33.99,65.89 34.69,65.89 IC7.13
SCLK  (via drill 0.36)
  Top 0.254: IC3.31 12.78,63.1 12.78,63.12 13.09,63.42 v14.28,63.42 16.01,63.42 17.56,61.87 v17.56,60.58 17.56,59.11 15.86,57.4 10.85,52.4 10.85,38 13.29,35.56 14.89,35.56 22.03,28.42 25.69,28.42 29.06,25.04 29.06,23.18 IC4.31 | IC2.31 30,102.37 30,102.34 30.31,102.03 31.12,102.03 31.63,101.52 31.63,100.46 arc-90 29.88,98.78 29.47,98.78 26.88,96.19 23.73,96.19 11.11,83.57 11.11,71.63 12.6,70.13 14.08,68.66 v14.08,67.56 | TP10.TP arc90 v39.4,59.36 TP3.TP | TP12.TP TP8.TP | TP8.TP TP3.TP | TP3.TP 39.27,59.36 v39.27,60.65 | TP3.TP TP8.TP
  Top 0.305: IC1.21 17.61,60.53 v17.56,60.58
  Top 0.406: v39.27,60.65 39.27,59.71 39.63,59.71 TP10.TP
  Bottom 0.254: v17.56,60.58 arc-90 17.61,60.63 | TP7.TP TP8.TP v39.4,59.36 | v14.28,63.42 14.08,63.63 v14.08,67.56
  Bottom 0.305: 39.27,60.07 39.27,62.08 37.29,64.06 25.71,64.06 22.18,60.53 17.61,60.53 v17.56,60.58 | TP8.TP 41.51,59.84 39.5,59.84
  Bottom 0.406: TP10.TP 39.5,59.84 39.27,60.07 v39.27,60.65
SDA/SDI/SDO
  Top 0.305: IC1.42 33.39,66.13 33.94,66.67 34.67,66.67 IC7.12
SDO
  Top 0.305: IC1.40 33.57,64.53 33.81,64.77 35.16,64.77 35.69,65.3 IC7.14
SIN  (via drill 0.36)
  Top 0.254: IC2.32 30.54,102.92 31.07,102.92 32.16,101.83 32.16,100.74 arc-90 30,98.35 27.34,95.68 23.96,95.68 11.69,83.41 11.69,71.91 14.71,68.88 14.98,68.62 v14.98,65.32
  Top 0.305: IC1.20 19.22,61.33 v19.06,61.34
  Bottom 0.254: TP5.TP TP6.TP | TP5.TP TP11.TP | TP5.TP 43.02,64.57 43.02,64.55
  Bottom 0.305: v14.98,65.32 16.19,64.11 17.35,64.11 17.61,64.11 18.88,62.84 18.88,61.52 v19.06,61.34 22.13,61.34 25.36,64.57 TP6.TP
  Bottom 0.406: 40.04,65.32 TP6.TP
SOUT
  Top 0.254: 44.84,65.25 44.74,65.25 TP9.TP TP1.TP TP2.TP
  Top 0.406: 42.22,64.39 TP1.TP 42.07,64.54 45.37,64.54 45.75,64.16 45.75,63.94 45.75,44.75 45.75,39.6 42.14,35.99 42.14,25.58 42.14,25.55 42.14,24.59 37.75,20.17 36.73,20.17 31.43,20.17 30.87,20.72 IC4.25
STAT  (via drill 0.36)
  Top 0.305: IC1.4 27.77,63.73 27.06,63.02 v24.06,60.02 | R4.1 24.03,53.5 v24.03,54.25
  Bottom 0.305: v24.03,54.25 24.06,54.25 v24.06,60.02
TX  (via drill 0.36)
  Top 0.305: 22.03,90.83 v22,90.86 22.03,90.83 | 22.03,90.83 22.03,83.82 18.37,80.16 18.37,78.18 18.37,67.92 18.37,64.59 19.23,63.73 IC1.17
  Bottom 0.305: IC6.13 v22,90.86
VCC  (via drill 0.36, 0.61)
  Top 0.254: v30.18,100.05 IC2.28 | C5.1 29.81,21.78 | C5.1 32.97,25.09 | 32.97,24.97 C5.1 | v12.35,65.1 13.16,64.29 v14.89,64.29 | IC5.3 23.76,46.61 23.76,45.52 | 23.27,45.9 IC5.3 | IC5.3 | IC5.3 23.45,46.63 23.45,45.97 23.6,46.13 23.6,46.63 23.27,46.3 23.27,45.69 | R8.2 28.18,76.83 29.83,76.83 30.75,76.06 Q1.2 | IC4.28 29.81,21.78 | 29.81,21.78 | SLOT1.P$1 42.4,9.78 | 41.87,9.78 41.99,9.78 | 36.1,73.91 36.05,73.97 | IC3.28 15.35,61.6 v16.03,62.28
  Top 0.305: C5.1 33.11,24.95 | IC5.3 IC5.4 | 33.53,63.73 IC1.39 29.95,63.73 29.9,63.73 29.39,64.24 | 33.53,63.73 34.07,64.26 35.54,64.26 36.66,65.38 36.66,65.86 IC7.1 v37.57,65.89 37.57,66.04 37.93,66.4 38.23,66.7 38.23,69.04 37.57,69.7 v37.57,69.9 | v37.57,69.9 v37.57,69.89 IC7.6 v37.57,69.9 | v17.38,63.07 18.32,62.13 IC1.19 21.85,62.13 v22.13,62.41 22.13,63.96 23.83,65.66 23.83,69.41 IC1.9 23.77,71.81 C7.1 | 28.58,57.97 IC1.31 28.57,62.34 29.39,63.17 29.39,64.24 | R9.2 32.24,75.73 | 31.38,74.02 31.32,73.97 30.99,73.97 | v33.53,62.94 33.53,63.73 | 33.86,25.68 33.86,26.01 32.42,27.46 32.42,30.94 32.42,31.48 R18.2 33.31,32.14 33.31,32.92 33.08,33.15 29.37,33.15 28.42,32.2 IC8.5 | IC5.3 | 29.39,64.24 29.39,65.41 29.39,65.63 v29.65,65.89
  Top 0.406: Q1.2 30.75,75.86 32.26,75.86 arc-90 R9.2 | 32.24,75.73 32.24,74.88 31.38,74.02 | C7.1 23.79,72.2 25.56,73.97 30.99,73.97 36.05,73.97 | v35.69,24.26 35.69,25.17 35.19,25.68 33.86,25.68 33.7,25.68 C5.1 | 28.58,57.97 v28.58,56.67 | v15.6,55.3 16.11,55.3 24.64,55.3 24.8,55.3 v26.17,53.92 | v37.57,69.9 37.57,72.44 36.1,73.91 | R16.2 28.39,32.13 IC8.5 | v30.08,53.82 C2.1
  Top 0.61: 23.76,45.52 23.45,45.72 | BATTERY1.2 35.24,46.91 36.61,48.28 36.61,50.82 35.69,51.74 29.3,51.74 R6.1 29.28,53.83 v30.08,53.82
  Top 0.813: BATTERY.2 30.61,46.38 C13.A 26.57,45.72
  Top 1.27: 24.77,45.28 31.15,45.62 BATTERY.2 | 24.77,45.28 24.77,44.07 22.64,41.55 14.94,41.53 v11.79,38.61 | 34.35,46.86 BATTERY1.2 34.45,46.89 34.4,46.84 34.4,45.67 34.14,45.41 30.74,45.41 31.15,45.82 BATTERY.2 | v44.35,8.36 SLOT1.P$1 42.2,9.78 | 42.2,9.78 41.99,9.78 42.2,9.78 | 42.2,9.78 41.87,9.78 v41.31,9.78 39.48,11.91 v39.48,16.15 | 23.76,45.52 23.78,45.54 23.93,45.39 25.2,45.39 | 25.2,45.39 30.46,45.39 | 24.77,45.28 30.51,45.74 31.55,46.56 30.21,46.56 25.25,46.56 25.25,45.95 25.2,45.39 | BATTERY.2 31.65,46.38 33.79,46.38 34.14,46.74 34.14,46.89 BATTERY.2 | BATTERY.2 29.8,45.54 26.37,45.54
  Bottom 0.254: 26.75,103.48 v30.18,100.05 31.61,100.05 C11.1 | C9.1 11.12,65.1 v12.35,65.1 | v14.89,64.29 16.03,63.14 v16.03,62.28 16.06,62.25 | 44.33,9.75 SLOT1.P$1 | v44.35,8.36 44.3,8.36 | 34.4,46.84 34.45,46.89 BATTERY1.2 | 11.77,38.56 v11.79,38.61
  Bottom 0.305: 4.43,70.84 3.99,70.8 LED8.A | 26.75,107.44 26.75,103.48 | v37.57,65.89 37.08,65.89 C1.1 | v37.57,69.9 37.08,69.9 C18.2 | v17.38,63.07 16.82,63.07 v16.03,62.28 | 14.18,55.3 14.13,55.35 | v22.13,62.41 21.38,63.16 C10.1 | C6.1 30.17,65.89 v29.65,65.89 | C8.1 33.55,62.93 v33.53,62.94 | v28.58,56.67 30.08,55.17 v30.08,53.82
  Bottom 0.406: 42.07,118.24 LED1.A | 22.21,103.25 22.31,103.35 | 9.31,83.05 9.1,82.57 | 7.38,77.15 7.22,76.66 | 9.33,40.21 9.3,40.22 | C14.A arc90 9.65,55.48 12.25,55.48 arc-90 C16.1 C15.1 | 14.13,55.35 15.35,55.35 v15.6,55.3 | v26.17,53.92 26.17,54.25 v28.58,56.67
  Bottom 0.61: 42.07,118.24 42.58,117.04 37.12,114.17 | 37.12,114.17 LED4.A | 31.71,111.12 LED7.A | 31.71,111.12 37.12,114.17 | 26.75,107.44 LED10.A | 26.75,107.44 30.57,110.28 31.71,111.12 | LED13.A 22.21,103.25 20.85,101.63 | 26.75,107.44 22.31,103.35 18.22,98.53 | 18.22,98.53 LED16.A | 14.76,93.45 LED19.A | 18.22,98.53 14.76,93.45 | 11.54,88.16 LED22.A | 14.76,93.45 11.54,88.16 | 9.1,82.57 LED2.A | 11.54,88.16 9.31,83.05 8.29,79.94 7.38,77.15 6.17,71 6,70.41 | 7.22,76.66 LED5.A | 6,70.41 3.99,70.8 | 5.44,64.57 LED11.A | 6,70.41 5.44,64.57 | 5.29,58.17 LED14.A | 5.44,64.57 5.29,58.17 | 6.15,52.12 LED17.A | 5.29,58.17 6.15,52.12 | 7.4,46.02 LED20.A | 6.15,52.12 7.4,46.02 | LED23.A 9.33,40.21 9.21,40.46 7.4,46.02 | 11.77,34.72 LED3.A | 9.3,40.22 11.77,34.72 | 15.04,29.34 LED6.A | 11.77,34.72 15.04,29.34 | 18.8,24.36 LED9.A | 15.04,29.34 18.8,24.36 | 23.07,19.84 LED12.A | 18.8,24.36 23.07,19.84 | 27.69,15.7 LED15.A | 23.07,19.84 27.69,15.7 | 32.75,12.17 LED18.A | 27.69,15.7 32.75,12.17 | 38.06,9.09 LED21.A | 32.75,12.17 38.06,9.09 | 38.06,9.09 43.64,6.68 | 27.69,15.7 v35.69,24.26 | 5.29,58.17 7.75,58.17 arc-90 9.35,56.57 9.35,55.93 arc-90 C14.A
  Bottom 0.813: JP1.4 9.22,79.02 8.29,79.94
  Bottom 1.27: LED24.A 43.64,6.68 44.33,7.26 44.33,8.33 44.33,9.75 | BATTERY.2 34.45,46.89 BATTERY1.2 | 34.4,46.84 34.4,39.06 | 34.4,39.06 34.4,38.68 | v41.31,9.78 42.2,9.78 SLOT1.P$1 | 10.42,37.9 11.77,38.56 | 34.4,39.06 34.4,37.36 36.94,34.82 39.48,32.28 39.48,21.74 | 39.48,21.74 39.48,19.91 39.48,16.36 v39.48,16.15 | 39.48,21.74 39.48,22.28
VDD  (via drill 0.36)
  Top 0.254: 25.78,90.63 R12.2
  Top 0.305: Q1.3 29.75,78.14 | 25.78,90.63 25.75,90.65 25.18,90.65 24.75,90.22 24.75,87.88 25.48,87.15 26.78,87.15 27.54,87.15 29.75,84.94 R10.2 | 23.93,82.37 24.55,82.99 LED.A 28,82.99 R10.2 | R10.2 29.94,86.2 30.87,87.12 32.91,87.12 R13.2 C17.1 35.65,86.4 R11.2
  Top 0.406: R9.1 arc90 32.26,77.66 29.8,77.66 Q1.3 29.5,78.56 29.19,78.87 23.83,78.87 23.27,79.43 23.27,81.71 23.93,82.37 v23.91,82.4
  Bottom 0.254: IC6.11 23.22,80.41
  Bottom 0.406: 23.22,80.41 23.22,81.66 23.93,82.37 v23.91,82.4
XLAT  (via drill 0.36)
  Top 0.254: IC2.26 28.66,100.16 28.66,99.8 26.04,97.18 23.27,97.18 9.94,83.84 9.94,71.07 12.12,68.88 v12.12,68.25 | IC3.26 12.55,60.6 v12.53,60.38 12.53,55.5 9.84,52.81 9.84,37.62 12.83,34.62 14.41,34.62 21.93,27.1 v26.04,27.1 | v31.53,21.82 31.24,21.82 IC4.26 | 43.44,12.32 SLOT1.P$2
  Top 0.305: IC1.23 19.07,57.98 v18.04,56.95
  Top 0.406: v31.53,21.82 31.93,21.41 v34.35,21.41
  Top 0.813: v42.58,13.18 43.44,12.32
  Bottom 0.254: v26.04,27.1 31.32,21.82 v31.53,21.82 | 43.44,12.32 SLOT1.P$2 | v12.53,60.38 12.53,63.4 12.99,63.86 12.99,66.19 12.12,67.06 v12.12,68.25
  Bottom 0.305: v18.04,56.95 14.33,56.95 12.53,58.75 v12.53,60.38
  Bottom 0.406: v42.58,13.18 40.47,13.18 35.16,18.49 35.16,20.6 v34.35,21.41
  Bottom 0.813: v42.58,13.18 43.44,12.32

## Text on the board
Top: M
tPlace: GND | BLANK | GND | charliex / mmca | DNP | VCC | RST | DNP | PDI | GND | OUTPUT | nullspacelabs.com | SCLK | GND | + | + | D- | USB | D+ | nullspacelabs.com | Mic | PWR | RST | XLAT | v3.1 | VCC
bPlace: GND | BLANK | Reset | INPUT | SCLK | D1 | nullspacelabs.com | Mode | XLAT | VCC